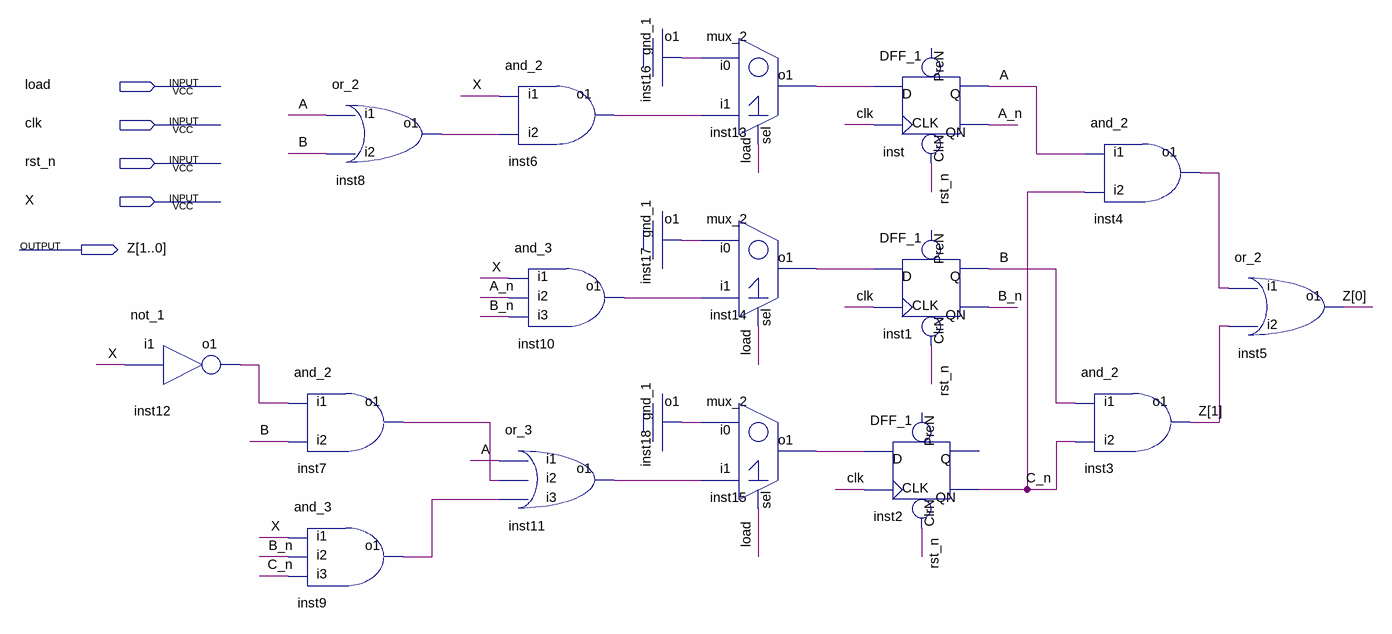
[diagram p0: schematic sheet]
// Quartus schematic Controller_num.bdf as structural Verilog: 19 symbols, 5 pins
module Controller_num (
  input  load,
  input  clk,
  input  rst_n,
  input  X,
  output [1:0] Z
);

  wire A, A_n, B, B_n, C_n, inst4_o1, inst6_o1, inst7_o1, inst8_o1, inst9_o1, inst10_o1, inst11_o1,
       inst12_o1, inst13_o1, inst14_o1, inst15_o1, inst16_o1, inst17_o1, inst18_o1;

  not_1 inst12 (.i1(X), .o1(inst12_o1));
  and_2 inst7 (.i1(inst12_o1), .i2(B), .o1(inst7_o1));
  and_3 inst9 (.i1(X), .i2(B_n), .i3(C_n), .o1(inst9_o1));
  or_2 inst8 (.i1(A), .i2(B), .o1(inst8_o1));
  and_2 inst6 (.i1(X), .i2(inst8_o1), .o1(inst6_o1));
  and_3 inst10 (.i1(X), .i2(A_n), .i3(B_n), .o1(inst10_o1));
  or_3 inst11 (.i1(A), .i2(inst7_o1), .i3(inst9_o1), .o1(inst11_o1));
  gnd_1 inst16 (.o1(inst16_o1));
  gnd_1 inst17 (.o1(inst17_o1));
  gnd_1 inst18 (.o1(inst18_o1));
  mux_2 inst13 (.sel(load), .i0(inst16_o1), .i1(inst6_o1), .o1(inst13_o1));
  mux_2 inst14 (.sel(load), .i0(inst17_o1), .i1(inst10_o1), .o1(inst14_o1));
  mux_2 inst15 (.sel(load), .i0(inst18_o1), .i1(inst11_o1), .o1(inst15_o1));
  DFF_1 inst (.CLK(clk), .D(inst13_o1), .ClrN(rst_n), .QN(A_n), .Q(A));  // open: PreN
  DFF_1 inst1 (.CLK(clk), .D(inst14_o1), .ClrN(rst_n), .QN(B_n), .Q(B));  // open: PreN
  DFF_1 inst2 (.CLK(clk), .D(inst15_o1), .ClrN(rst_n), .QN(C_n));  // open: PreN, Q
  and_2 inst4 (.i1(A), .i2(C_n), .o1(inst4_o1));
  and_2 inst3 (.i1(B), .i2(C_n), .o1(Z[1]));
  or_2 inst5 (.i1(inst4_o1), .i2(Z[1]), .o1(Z[0]));
endmodule
